# EasyEDA Pro project ProPrj_电刺激发生单元2_2024-08-09.epro

# Schematic Schematic1
Create Date: 2024-01-28; Page Name: P1; Project Name: 电刺激发生单元2; Schematic Name: Schematic1; Update Date: 2024-02-19; Company: 嘉立创EDA; Page Size: A4; Version: V1.0
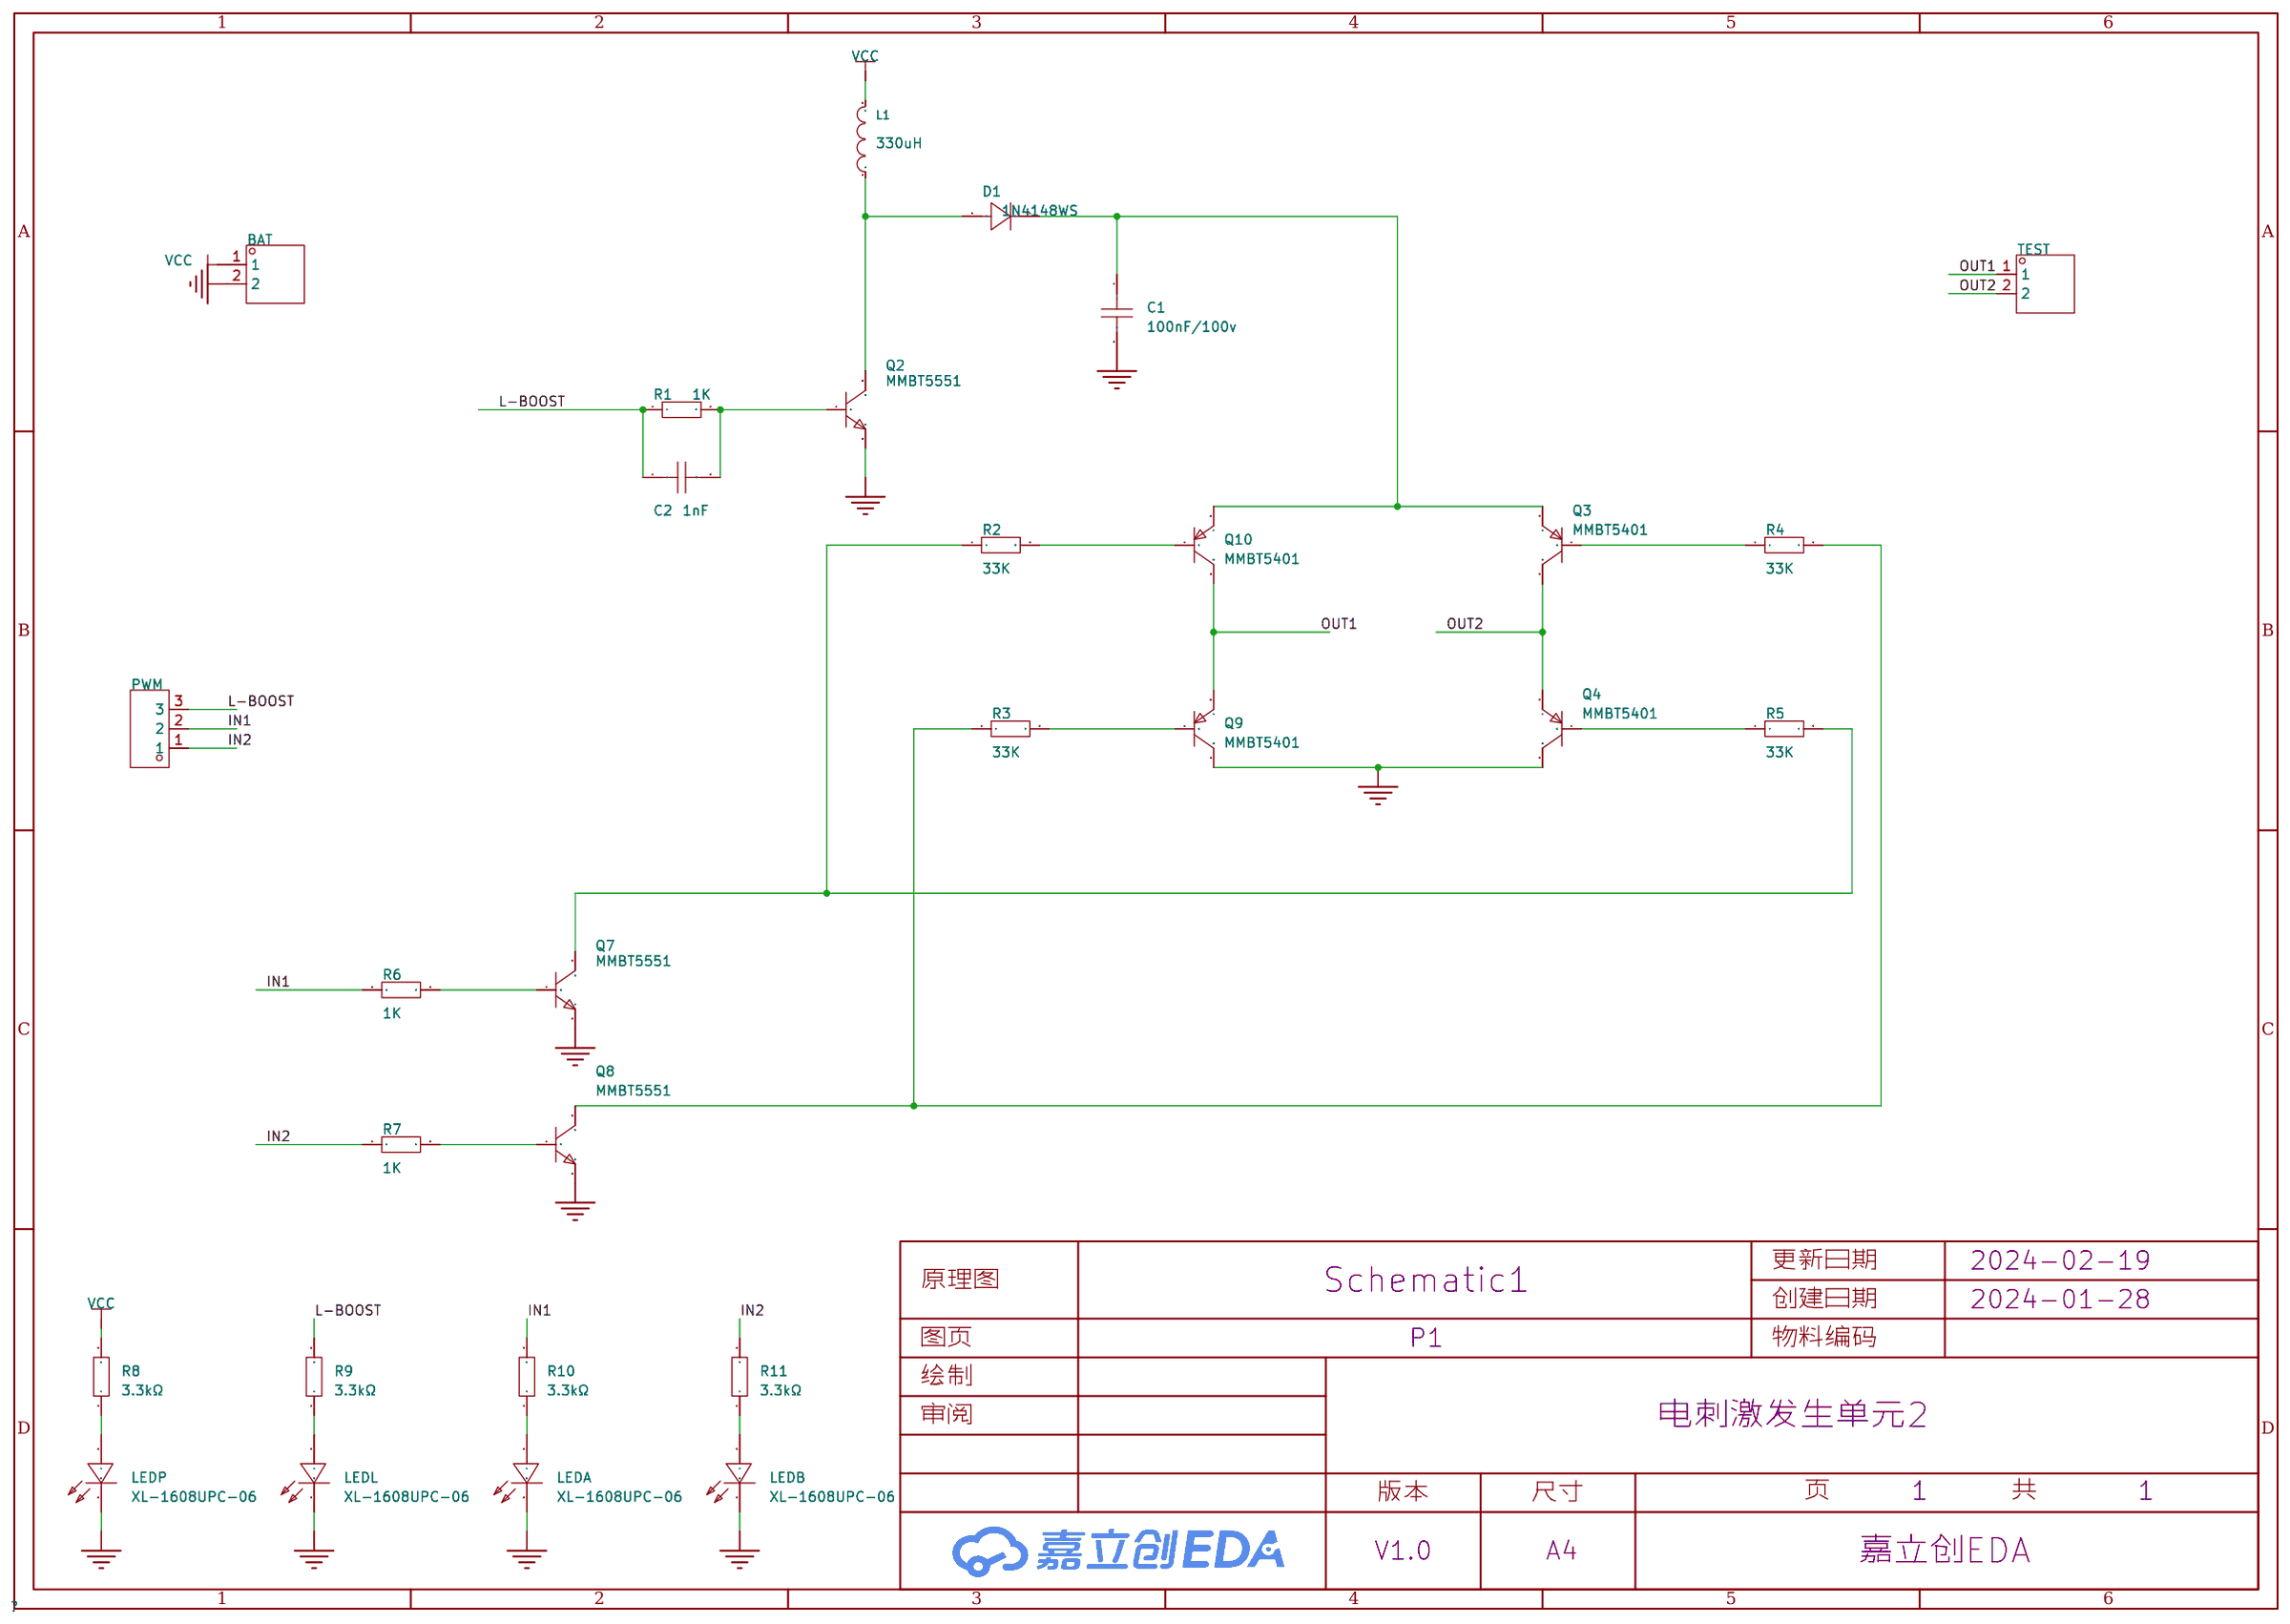
[diagram p0: schematic sheet]

## Parts
BAT  -  [HDR-TH_2P-P2.54-V-M-1]
C1  100nF  [C0603]
C2  1nF  [C0603]
D1  1N4148WS  [SOD-323_L1.8-W1.3-LS2.5-RD]
L1  330uH  [IND-SMD_L4.0-W4.0_FNR40XXS]
LEDA  XL-1608UPC-06  [LED0603-RD_PINK]
LEDB  XL-1608UPC-06  [LED0603-RD_PINK]
LEDL  XL-1608UPC-06  [LED0603-RD_PINK]
LEDP  XL-1608UPC-06  [LED0603-RD_PINK]
PWM  -  [HDR-TH_3P-P2.54-V-M]
Q2  MMBT5551  [SOT-23-3_L2.9-W1.3-P1.90-LS2.4-BR]
Q3  MMBT5401  [SOT-23-3_L2.9-W1.3-P1.90-LS2.4-BR]
Q4  MMBT5401  [SOT-23-3_L2.9-W1.3-P1.90-LS2.4-BR]
Q7  MMBT5551  [SOT-23-3_L2.9-W1.3-P1.90-LS2.4-BR]
Q8  MMBT5551  [SOT-23-3_L2.9-W1.3-P1.90-LS2.4-BR]
Q9  MMBT5401  [SOT-23-3_L2.9-W1.3-P1.90-LS2.4-BR]
Q10  MMBT5401  [SOT-23-3_L2.9-W1.3-P1.90-LS2.4-BR]
R1  1K  [R0603]
R2  33K  [R0603]
R3  33K  [R0603]
R4  33K  [R0603]
R5  33K  [R0603]
R6  1K  [R0603]
R7  1K  [R0603]
R8  3.3kΩ  [R0603]
R9  3.3kΩ  [R0603]
R10  3.3kΩ  [R0603]
R11  3.3kΩ  [R0603]
TEST  -  [HDR-TH_2P-P2.54-V-M-1]

## Library data of the parts
BAT TEST = HDR-M_2.54_1x2P: Supplier Part: C124375; Supplier Footprint: 插件
C1 = CL10B104KC8NNNC: 容值:100nF;精度:±10%;额定电压:100V;材质(温度系数):X7R;; LCSC Part Name: 100nF ±10% 100V; Supplier Part: C15725; Manufacturer: SAMSUNG(三星); Supplier Footprint: 0603; JLCPCB Part Class: Extended Part; Datasheet: https://atta.szlcsc.com/upload/public/pdf/source/20160218/1457707763339.pdf; Supplier: LCSC; Tolerance: ±10%; Voltage Rated: 100V; Temperature Coefficient: X7R
C2 = CL10B102KC8NNNC: 容值:1nF;精度:±10%;额定电压:100V;材质(温度系数):X7R;; LCSC Part Name: 1nF ±10% 100V; Supplier Part: C153291; Manufacturer: SAMSUNG(三星); Supplier Footprint: 0603; JLCPCB Part Class: Extended Part; Datasheet: https://atta.szlcsc.com/upload/public/pdf/source/20160218/1457707763339.pdf; Supplier: LCSC; Tolerance: ±10%; Voltage Rated: 100V; Temperature Coefficient: X7R
D1 = 1N4148WS_C727111: 二极管配置:独立式;正向压降(Vf):1.25V@150mA;直流反向耐压(Vr):100V;平均整流电流(Io):300mA;功率:400mW;反向恢复时间(trr):8ns;; LCSC Part Name: 电压:100V 电流:300mA; Supplier Part: C727111; Manufacturer: TWGMC(台湾迪嘉); Supplier Footprint: SOD-323; JLCPCB Part Class: Extended Part; Datasheet: https://atta.szlcsc.com/upload/public/pdf/source/20200828/C727111_E7108F014A9288D320E3440593CCDF54.pdf; Supplier: LCSC; Diode Configuration: 独立式; Forward Voltage (Vf@If): 1.25V@150mA; Reverse Voltage (Vr): 100V; Average Rectified Current (Io): 300mA; Power Dissipation: 400mW; Reverse Leakage Current: 1uA@75V; Reverse Recovery Time (trr): 8ns; Operating Temperature: -55℃~+150℃@(Tj)
L1 = FNR4030S331MT: 电感值:330uH;精度:±20%;额定电流:260mA;饱和电流(Isat):400mA;; LCSC Part Name: 330uH ±20% 400mA; Supplier Part: C167900; Manufacturer: cjiang(长江微电); Supplier Footprint: SMD,4x4x3mm; JLCPCB Part Class: Extended Part; Datasheet: https://atta.szlcsc.com/upload/public/pdf/source/20190327/C167925_9EFF0AABC4CA629C2CC95961DBF7D39D.pdf; Supplier: LCSC; Tolerance: ±20%; Rated Current: 260mA; DC Resistance (DCR): 5.2Ω; Saturation Current (Isat): 400mA
LEDA LEDB LEDL LEDP = XL-1608UPC-06: 灯头类型:-;发光颜色:粉色;正向电压(VF):-;功率:80mW;正向电流:5mA;主波长:-;二极管配置:-;透镜颜色:粉色透镜;色温:-;发光强度:-;发光角度:120°;载带方式:正贴;工作温度:-30℃~+85℃;; Supplier Part: C2977076; Manufacturer: XINGLIGHT(成兴光); Supplier Footprint: 0603; JLCPCB Part Class: 扩展库; Datasheet: https://atta.szlcsc.com/upload/public/pdf/source/20221102/10CD74551B91639B3CF9699D266872B7.pdf; Supplier: LCSC; Emitted Color: 粉色; Power Dissipation: 80mW; Forward Current: 5mA; Lens Color: 粉色透镜; Viewing Angle: 120°; Mounting Sytle: 正贴; Operating Temperature: -30℃~+85℃
PWM = HDR-M_2.54_1x3P: Supplier Part: C2937625; Supplier Footprint: 插件
Q2 Q7 Q8 = MMBT5551_C511877: 晶体管类型:-;集电极电流(Ic):600mA;集射极击穿电压(Vceo):160V;功率(Pd):300mW;直流电流增益(hFE@Ic,Vce):100@10mA,5V;; LCSC Part Name: 电流:600mA 耐压:160V; Supplier Part: C511877; Manufacturer: BORN(伯恩半导体); Supplier Footprint: SOT-23; JLCPCB Part Class: 扩展库; Datasheet: https://atta.szlcsc.com/upload/public/pdf/source/20200413/C511877_5FB572CA080610ED71DCB0A2B79AF8E8.pdf; Supplier: LCSC; Collector Current (Ic): 600mA; Collector-Emitter Breakdown Voltage (Vceo): 160V; Power Dissipation (Pd): 300mW; DC Current Gain (hFE@Ic,Vce): 100@10mA,5V; Transition Frequency (fT): 300MHz; Collector Cut-Off Current (Icbo): 50nA; Collector-Emitter Saturation Voltage (VCE(sat)@Ic,Ib): 200mV@50mA,5mA
Q3 Q4 Q9 Q10 = MMBT5401_C8326: 晶体管类型:PNP;集电极电流(Ic):600mA;集射极击穿电压(Vceo):150V;功率(Pd):300mW;直流电流增益(hFE@Ic,Vce):200@10mA,5V;; LCSC Part Name: PNP 电流:600mA 耐压:150V hfe=200~300; Supplier Part: C8326; Manufacturer: CJ(江苏长电/长晶); Supplier Footprint: SOT-23; JLCPCB Part Class: 基础库; Datasheet: https://atta.szlcsc.com/upload/public/pdf/source/20140809/1457707213644.pdf; Supplier: LCSC; Transistor Type: PNP; Collector Current (Ic): 600mA; Collector-Emitter Breakdown Voltage (Vceo): 150V; Power Dissipation (Pd): 300mW; DC Current Gain (hFE@Ic,Vce): 200@10mA,5V; Transition Frequency (fT): 100MHz; Collector Cut-Off Current (Icbo): 100nA; Collector-Emitter Saturation Voltage (VCE(sat)@Ic,Ib): 500mV@50mA,5mA
R1-R7 = Res_0603: Supplier Footprint: 0603
R8-R11 = 0603WAF3301T5E: 阻值:3.3kΩ;精度:±1%;功率:100mW;温度系数:±100ppm/℃;电阻类型:厚膜电阻;; LCSC Part Name: 3.3kΩ ±1% 100mW 厚膜电阻; Supplier Part: C22978; Manufacturer: UNI-ROYAL(厚声); Supplier Footprint: 0603; JLCPCB Part Class: 基础库; Datasheet: https://atta.szlcsc.com/upload/public/pdf/source/20200306/C422600_1E6D84923E4A46A82E41ADD87F860B5C.pdf; Supplier: LCSC; Tolerance: ±1%; Power(Watts): 100mW; Overload Voltage (Max): 75V; Temperature Coefficient: ±100ppm/℃; Type: 厚膜电阻; Operating Temperature Range: -55℃~+155℃

## Nets
GND: BAT.2 C1.2 LEDA.1(C) LEDB.1(C) LEDL.1(C) LEDP.1(C) Q2.2(E) Q4.3(C) Q7.2(E) Q8.2(E) Q9.3(C)
VCC: BAT.1 L1.2 R8.2
IN1: PWM.2 R6.1 R10.2
IN2: PWM.1 R7.1 R11.2
L-BOOST: C2.1 PWM.3 R1.1 R9.2
OUT1: Q9.2(E) Q10.3(C) TEST.1
OUT2: Q3.3(C) Q4.2(E) TEST.2
$1N633: C2.2 Q2.1(B) R1.2
$1N635: C1.1 D1.1(K) Q3.2(E) Q10.2(E)
$1N636: Q10.1(B) R2.2
$1N637: Q4.1(B) R5.1
$1N638: Q9.1(B) R3.2
$1N639: Q7.3(C) R2.1 R5.2
$1N640: Q3.1(B) R4.1
$1N641: Q8.3(C) R3.1 R4.2
$1N644: Q7.1(B) R6.2
$1N645: Q8.1(B) R7.2
$1N1569: D1.2(A) L1.1 Q2.3(C)
$1N3237: LEDP.2(A) R8.1
$1N5710: LEDL.2(A) R9.1
$1N5808: LEDA.2(A) R10.1
$1N5903: LEDB.2(A) R11.1

# Schematic Schematic2
Create Date: 2024-02-03; Page Name: P1; Project Name: 电刺激发生单元2; Schematic Name: Schematic2; Update Date: 2024-02-03; Company: 嘉立创EDA; Page Size: A4; Version: V1.0
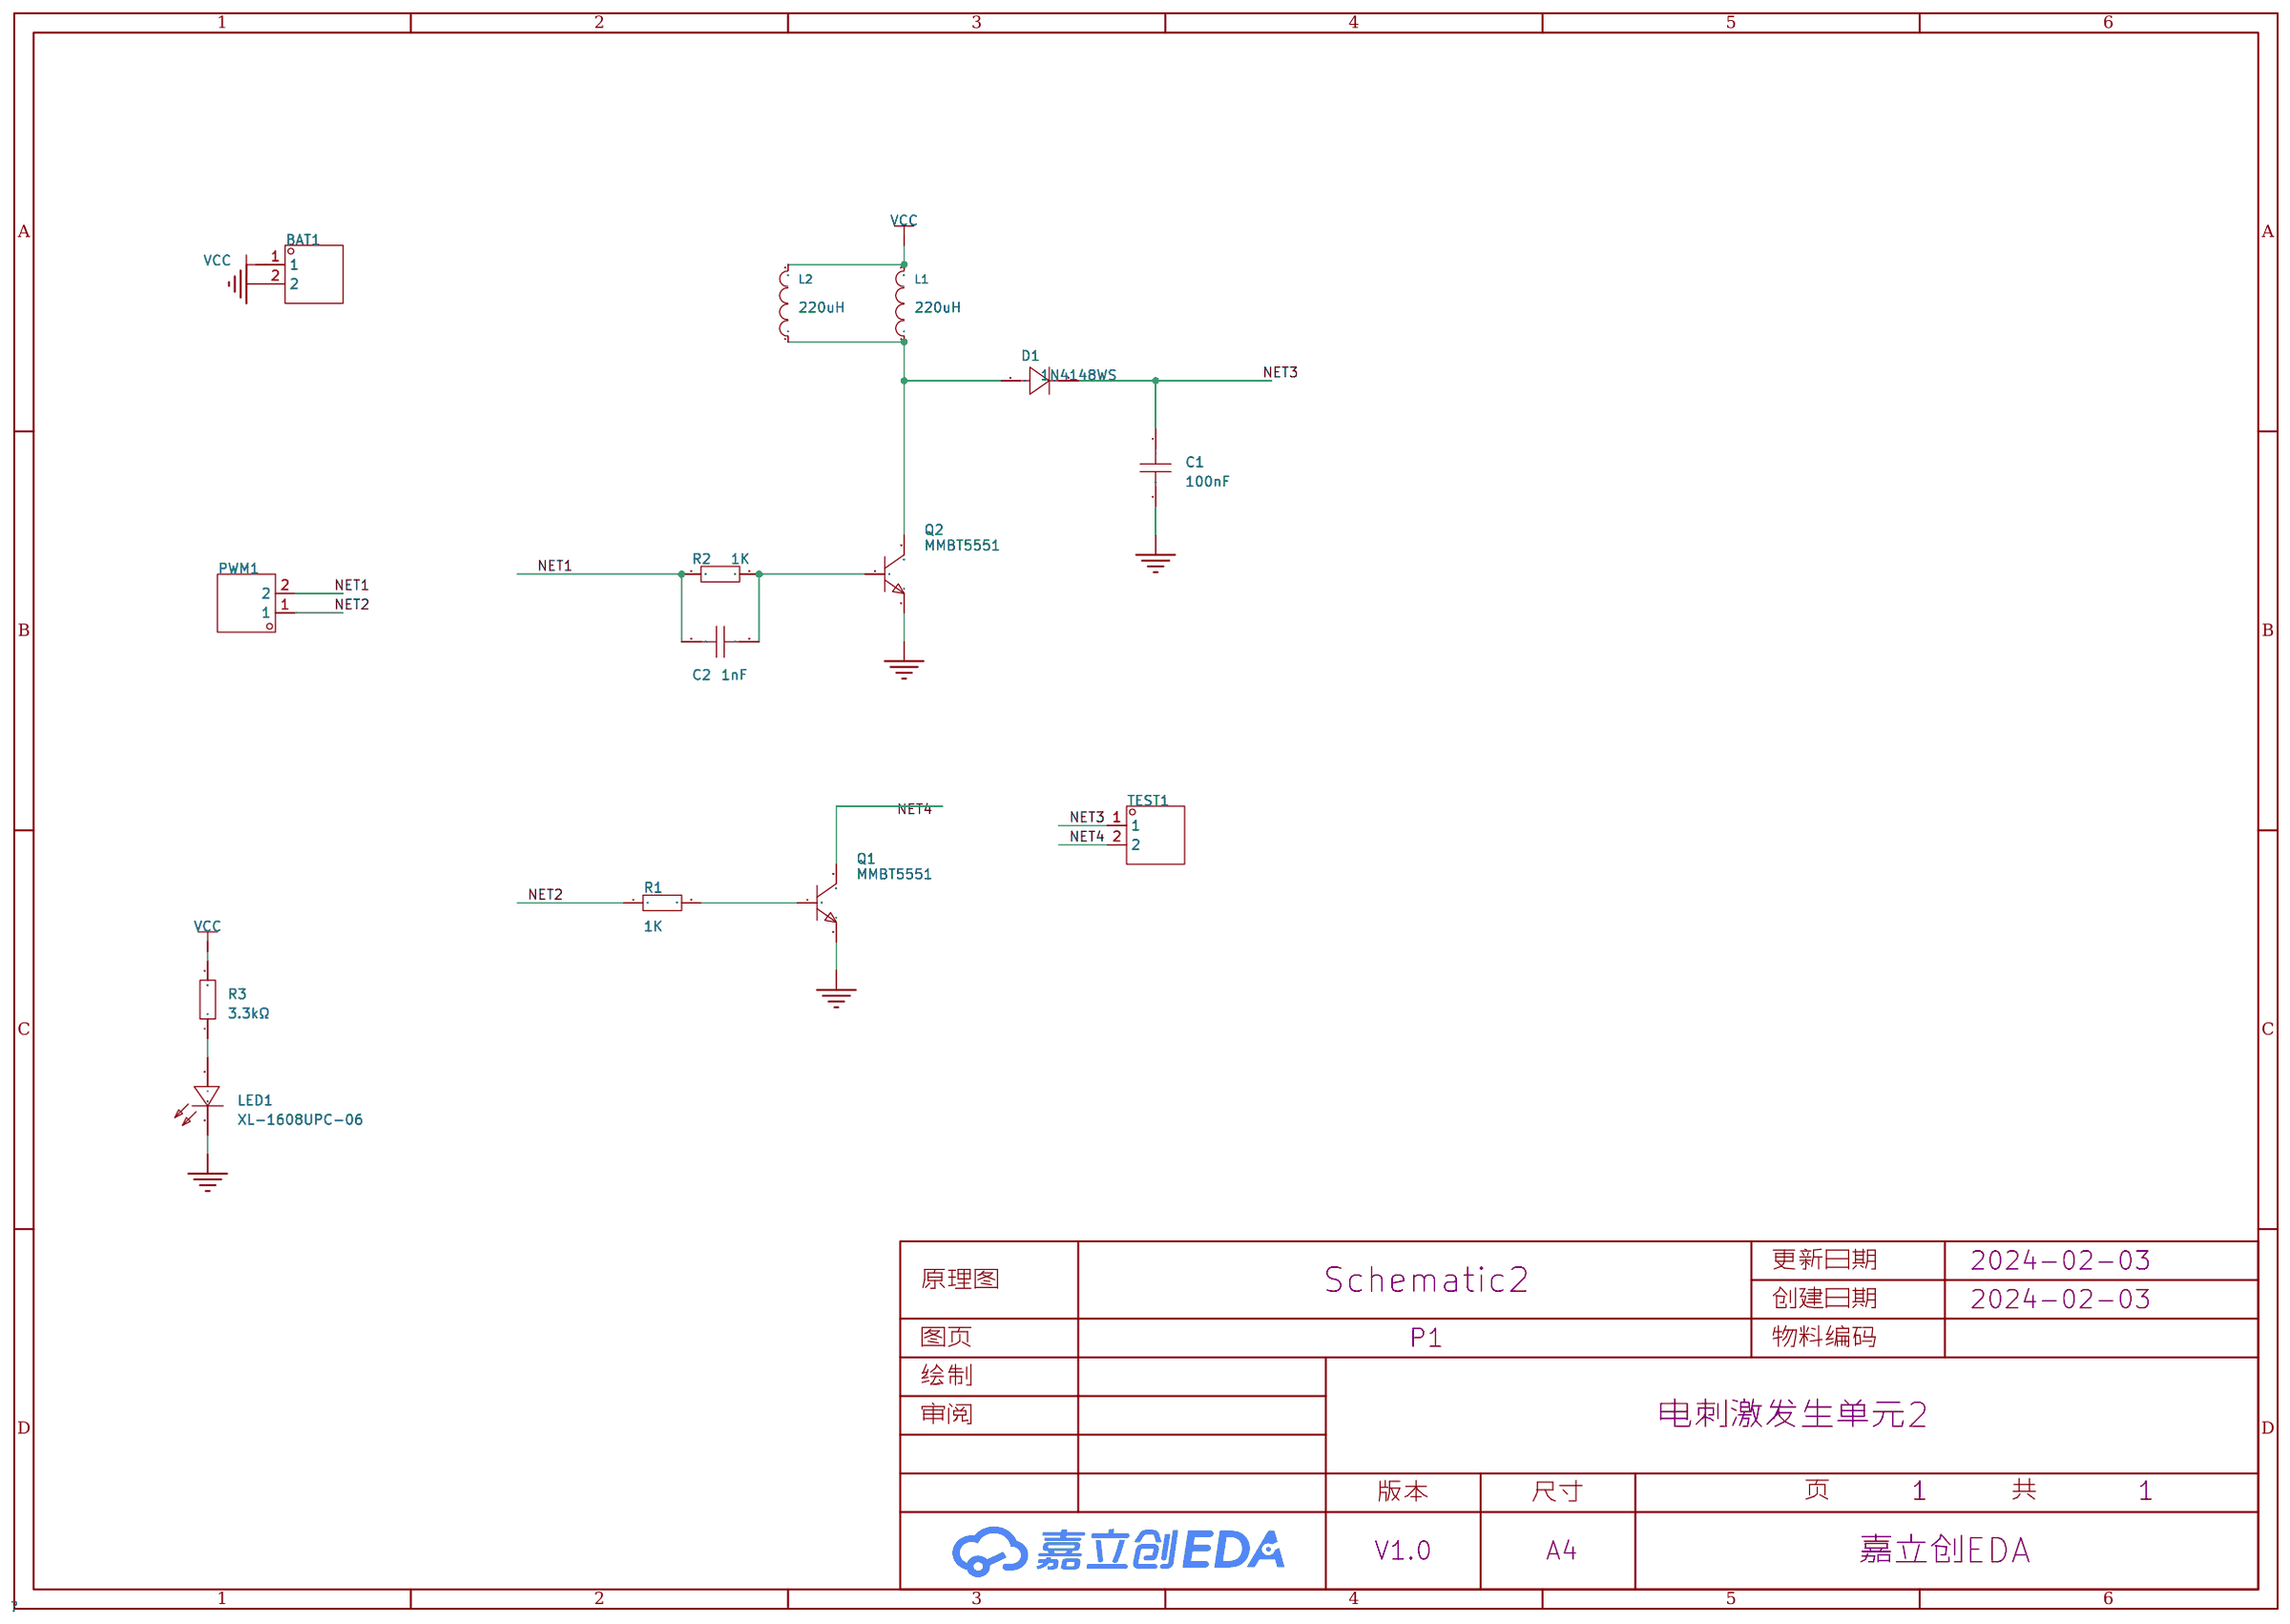
[diagram p1: schematic sheet]

## Parts
BAT1  -  [HDR-TH_2P-P2.54-V-M-1]
C1  100nF  [C0805]
C2  1nF  [C0603]
D1  1N4148WS  [SOD-323_L1.8-W1.3-LS2.5-RD]
L1  220uH  [IND-SMD_L3.0-W3.0_LVS303015H-2R2M-N]
L2  220uH  [L1207]
LED1  XL-1608UPC-06  [LED0603-RD_PINK]
PWM1  -  [HDR-TH_2P-P2.54-V-M-1]
Q1  MMBT5551  [SOT-23-3_L2.9-W1.3-P1.90-LS2.4-BR]
Q2  MMBT5551  [SOT-23-3_L2.9-W1.3-P1.90-LS2.4-BR]
R1  1K  [R0603]
R2  1K  [R0603]
R3  3.3kΩ  [R0603]
TEST1  -  [HDR-TH_2P-P2.54-V-M-1]

## Library data of the parts
BAT1 PWM1 TEST1 = HDR-M_2.54_1x2P: Supplier Part: C124375; Supplier Footprint: 插件
C1 = CL21B104KCFNNNE: 容值:100nF;精度:±10%;额定电压:100V;材质(温度系数):X7R;; LCSC Part Name: 100nF ±10% 100V; Supplier Part: C28233; Manufacturer: SAMSUNG(三星); Supplier Footprint: 0805; JLCPCB Part Class: Basic Part; Datasheet: https://atta.szlcsc.com/upload/public/pdf/source/20160218/1457707763339.pdf; Supplier: LCSC; Tolerance: ±10%; Voltage Rated: 100V; Temperature Coefficient: X7R
C2 = CL10B102KC8NNNC: 容值:1nF;精度:±10%;额定电压:100V;材质(温度系数):X7R;; LCSC Part Name: 1nF ±10% 100V; Supplier Part: C153291; Manufacturer: SAMSUNG(三星); Supplier Footprint: 0603; JLCPCB Part Class: Extended Part; Datasheet: https://atta.szlcsc.com/upload/public/pdf/source/20160218/1457707763339.pdf; Supplier: LCSC; Tolerance: ±10%; Voltage Rated: 100V; Temperature Coefficient: X7R
D1 = 1N4148WS_C727111: 二极管配置:独立式;正向压降(Vf):1.25V@150mA;直流反向耐压(Vr):100V;平均整流电流(Io):300mA;功率:400mW;反向恢复时间(trr):8ns;; LCSC Part Name: 电压:100V 电流:300mA; Supplier Part: C727111; Manufacturer: TWGMC(台湾迪嘉); Supplier Footprint: SOD-323; JLCPCB Part Class: Extended Part; Datasheet: https://atta.szlcsc.com/upload/public/pdf/source/20200828/C727111_E7108F014A9288D320E3440593CCDF54.pdf; Supplier: LCSC; Diode Configuration: 独立式; Forward Voltage (Vf@If): 1.25V@150mA; Reverse Voltage (Vr): 100V; Average Rectified Current (Io): 300mA; Power Dissipation: 400mW; Reverse Leakage Current: 1uA@75V; Reverse Recovery Time (trr): 8ns; Operating Temperature: -55℃~+150℃@(Tj)
L1 = XRCD32-221K: 电感值:220uH;精度:±10%;; LCSC Part Name: 220uH ±10%; Supplier Part: C5289391; Manufacturer: XR(祥如); Supplier Footprint: SMD,2.1x3mm; JLCPCB Part Class: Extended Part; Datasheet: https://atta.szlcsc.com/upload/public/pdf/source/20231010/F8DFC35BD01DC108FC822E3F44DEF6B3.pdf; Supplier: LCSC; Tolerance: ±10%; Rated Current: 260mA; DC Resistance (DCR): 5.2Ω; Saturation Current (Isat): 400mA
L2 = LB3218T221M: 电感值:220uH;精度:±20%;额定电流:80mA;饱和电流(Isat):-;直流电阻(DCR):5.4Ω;; LCSC Part Name: 220uH ±20%; Supplier Part: C223393; Manufacturer: TAIYO YUDEN(太诱); Supplier Footprint: 1206; JLCPCB Part Class: Extended Part; Datasheet: https://atta.szlcsc.com/upload/public/pdf/source/20190423/C223308_BFD65E337BAACD8D50F53C3994BF310F.pdf; Supplier: LCSC; Tolerance: ±20%; Rated Current: 80mA; DC Resistance (DCR): 5.4Ω; Frequency - Self Resonant: 252kHz; Type: 绕线片式电感
LED1 = XL-1608UPC-06: 灯头类型:-;发光颜色:粉色;正向电压(VF):-;功率:80mW;正向电流:5mA;主波长:-;二极管配置:-;透镜颜色:粉色透镜;色温:-;发光强度:-;发光角度:120°;载带方式:正贴;工作温度:-30℃~+85℃;; Supplier Part: C2977076; Manufacturer: XINGLIGHT(成兴光); Supplier Footprint: 0603; JLCPCB Part Class: 扩展库; Datasheet: https://atta.szlcsc.com/upload/public/pdf/source/20221102/10CD74551B91639B3CF9699D266872B7.pdf; Supplier: LCSC; Emitted Color: 粉色; Power Dissipation: 80mW; Forward Current: 5mA; Lens Color: 粉色透镜; Viewing Angle: 120°; Mounting Sytle: 正贴; Operating Temperature: -30℃~+85℃
Q1 Q2 = MMBT5551_C511877: 晶体管类型:-;集电极电流(Ic):600mA;集射极击穿电压(Vceo):160V;功率(Pd):300mW;直流电流增益(hFE@Ic,Vce):100@10mA,5V;; LCSC Part Name: 电流:600mA 耐压:160V; Supplier Part: C511877; Manufacturer: BORN(伯恩半导体); Supplier Footprint: SOT-23; JLCPCB Part Class: 扩展库; Datasheet: https://atta.szlcsc.com/upload/public/pdf/source/20200413/C511877_5FB572CA080610ED71DCB0A2B79AF8E8.pdf; Supplier: LCSC; Collector Current (Ic): 600mA; Collector-Emitter Breakdown Voltage (Vceo): 160V; Power Dissipation (Pd): 300mW; DC Current Gain (hFE@Ic,Vce): 100@10mA,5V; Transition Frequency (fT): 300MHz; Collector Cut-Off Current (Icbo): 50nA; Collector-Emitter Saturation Voltage (VCE(sat)@Ic,Ib): 200mV@50mA,5mA
R1 R2 = Res_0603: Supplier Footprint: 0603
R3 = 0603WAF3301T5E: 阻值:3.3kΩ;精度:±1%;功率:100mW;温度系数:±100ppm/℃;电阻类型:厚膜电阻;; LCSC Part Name: 3.3kΩ ±1% 100mW 厚膜电阻; Supplier Part: C22978; Manufacturer: UNI-ROYAL(厚声); Supplier Footprint: 0603; JLCPCB Part Class: 基础库; Datasheet: https://atta.szlcsc.com/upload/public/pdf/source/20200306/C422600_1E6D84923E4A46A82E41ADD87F860B5C.pdf; Supplier: LCSC; Tolerance: ±1%; Power(Watts): 100mW; Overload Voltage (Max): 75V; Temperature Coefficient: ±100ppm/℃; Type: 厚膜电阻; Operating Temperature Range: -55℃~+155℃

## Nets
GND: BAT1.2 C1.2 LED1.1(C) Q1.2(E) Q2.2(E)
VCC: BAT1.1 L1.2 L2.2 R3.2
NET1: C2.1 PWM1.2 R2.1
NET2: PWM1.1 R1.1
NET3: C1.1 D1.1(K) TEST1.1
NET4: Q1.3(C) TEST1.2
$1N914: C2.2 Q2.1(B) R2.2
$1N925: Q1.1(B) R1.2
$1N950: LED1.2(A) R3.1
$1N1295: D1.2(A) L1.1 L2.1 Q2.3(C)

# Board PCB1
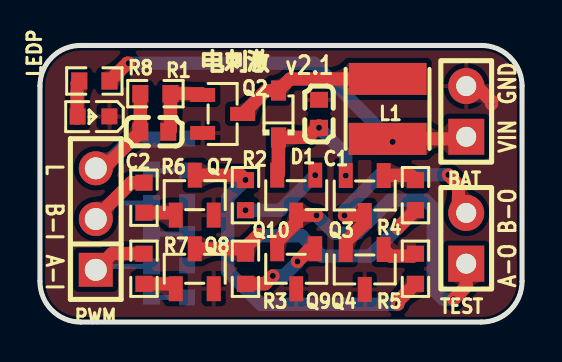
[diagram p2: board, top side]
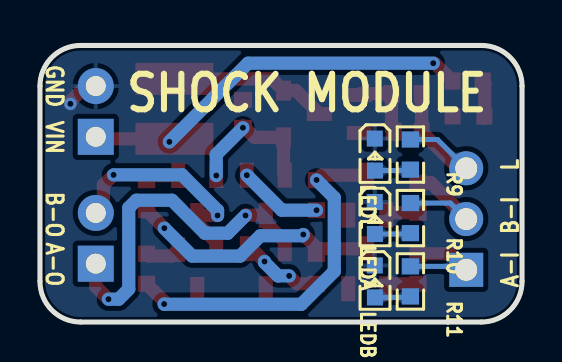
[diagram p3: board, bottom side, seen from below]

Outline 24.13 x 13.84 mm; copper layers: Top Layer, Bottom Layer. Coordinates in mm from the lower left corner of the outline.
Outline path: 0,11.81 0,2.03 arc(0.6,0.6) 2.03,0 22.1,0 arc(23.53,0.6) 24.13,2.03 24.13,11.81 arc(23.53,13.25) 22.1,13.84 2.03,13.84 arc(0.6,13.25) 0,11.81
Stack: Top Layer 0.035mm / Dielectric1 1.51mm FR4 er 4.5 / Bottom Layer 0.035mm

## Design rules (mm)
template: JLCPCB Capability(Two Layers Board)
spacing copperThickness1oz (default): track to track 0.102, other pairs 0.152 to 0.3
spacing copperThickness2oz: track to track 0.203, other pairs 0.152 to 0.3
track width copperThickness1oz (default): min 0.127, default 0.254, max 2.54
track width copperThickness2oz: min 0.203, default 0.254, max 2.54
differential pair differentialPair (default): width min 0.127, default 0.254, max 2.54; gap min 0.152, default 0.152
via viaSize (default): diameter min 0.5, default 0.61, max 10; hole min 0.3, default 0.305, max 6.3

## Placement (name value [footprint] x y rotation side)
BAT  -  [HDR-TH_2P-P2.54-V-M-1]  21.34 10.54 90 top
C1  100nF  [C0603]  13.97 10.42 90 top
C2  1nF  [C0603]  5.72 9.53 0 top
D1  1N4148WS  [SOD-323_L1.8-W1.3-LS2.5-RD]  11.94 10.41 90 top
L1  330uH  [IND-SMD_L4.0-W4.0_FNR40XXS]  17.4 10.67 270 top
LEDA  XL-1608UPC-06  [LED0603-RD_PINK]  7.37 5.21 270 bottom
LEDB  XL-1608UPC-06  [LED0603-RD_PINK]  7.37 2.03 270 bottom
LEDL  XL-1608UPC-06  [LED0603-RD_PINK]  7.37 8.38 270 bottom
LEDP  XL-1608UPC-06  [LED0603-RD_PINK]  2.68 10.29 180 top
PWM  -  [HDR-TH_3P-P2.54-V-M]  2.79 5.15 90 top
Q2  MMBT5551  [SOT-23-3_L2.9-W1.3-P1.90-LS2.4-BR]  9.14 10.41 180 top
Q3  MMBT5401  [SOT-23-3_L2.9-W1.3-P1.90-LS2.4-BR]  16.26 6.33 90 top
Q4  MMBT5401  [SOT-23-3_L2.9-W1.3-P1.90-LS2.4-BR]  16.26 2.63 90 top
Q7  MMBT5551  [SOT-23-3_L2.9-W1.3-P1.90-LS2.4-BR]  7.75 6.35 270 top
Q8  MMBT5551  [SOT-23-3_L2.9-W1.3-P1.90-LS2.4-BR]  7.75 2.67 270 top
Q9  MMBT5401  [SOT-23-3_L2.9-W1.3-P1.90-LS2.4-BR]  12.83 2.67 90 top
Q10  MMBT5401  [SOT-23-3_L2.9-W1.3-P1.90-LS2.4-BR]  12.83 6.35 90 top
R1  1K  [R0603]  5.78 11.43 0 top
R2  33K  [R0603]  10.29 6.35 270 top
R3  33K  [R0603]  10.29 2.67 270 top
R4  33K  [R0603]  18.8 6.35 270 top
R5  33K  [R0603]  18.8 2.67 270 top
R6  1K  [R0603]  5.21 6.22 270 top
R7  1K  [R0603]  5.21 2.67 270 top
R8  3.3kΩ  [R0603]  2.72 12.06 0 top
R9  3.3kΩ  [R0603]  5.59 8.38 90 bottom
R10  3.3kΩ  [R0603]  5.59 5.2 90 bottom
R11  3.3kΩ  [R0603]  5.59 2.03 90 bottom
TEST  -  [HDR-TH_2P-P2.54-V-M-1]  21.34 4.19 90 top

## Footprints (pads in the part's own frame, mm; a bottom-side part is the same pattern mirrored in y, then rotated)
C0603
  rect 0.8x0.9 smd: 1(-0.7,0) 2(0.7,0)
HDR-TH_2P-P2.54-V-M-1
  rect 1.8x1.8 hole 1: 1(-1.27,0)
  round 1.8 hole 1: 2(1.27,0)
HDR-TH_3P-P2.54-V-M
  rect 1.7x1.7 hole 1.1: 1(-2.54,0)
  round 1.7 hole 1.1: 2(0,0) 3(2.54,0)
IND-SMD_L4.0-W4.0_FNR40XXS
  rect 1.6x3.9 smd: 1(-1.5,0) 2(1.5,0)
LED0603-RD_PINK
  rect 0.8x0.8 smd: 1(-0.799,-0.004) 2(0.799,0.004)
R0603
  rect 0.806x0.864 smd: 1(-0.753,0) 2(0.753,0)
SOD-323_L1.8-W1.3-LS2.5-RD
  rect 1x0.75 smd: 1(-1.173,0) 2(1.173,0)
SOT-23-3_L2.9-W1.3-P1.90-LS2.4-BR
  rect 1.25x0.7 smd: 1(1,-0.95) 2(1,0.95) 3(-1,0)

## Nets
As in the schematic.

## Via types
v1: diameter 0.61, hole 0.305, Top Layer to Bottom Layer, 17 vias

## Routing (per net, layer and track width the routed paths; a pad name or vN(x,y) marks a point on that pad's centre or on a via; arc(x,y) is an arc through that point)
GND: length 1.7
  Top Layer w0.66: v1(22.61,10.92) 22.61,11.05 21.84,11.81 BAT.2
VCC: length 20.5
  Top Layer w0.66: 3.48,12.06 4.37,12.95 v1(4.44,12.95) ; BAT.1 21.23,9.17 L1.2 17.55,9.02 v1(17.65,9.02)
  Bottom Layer w0.66: v1(17.65,9.02) 13.72,12.95 v1(4.44,12.95)
IN1: length 6.3
  Top Layer w0.66: R6.1 4.56,6.98 2.79,5.21 PWM.2
  Bottom Layer w0.254: PWM.2 3.6,5.96 5.59,5.96
IN2: length 5.6
  Top Layer w0.66: 2.79,2.61 3.6,3.42 R7.1
  Bottom Layer w0.254: 2.79,2.61 2.97,2.79 R11.2
L-BOOST: length 8.3
  Top Layer w0.66: PWM.3 3.19,7.69 C2.1 5.03,9.53 R1.1
  Bottom Layer w0.254: R9.2 4.24,9.14 PWM.3
OUT1: length 17.5
  Top Layer w0.66: v1(20.7,1.14) 21.34,1.78 TEST.1 ; Q9.2 11.88,4.03 12.83,4.98 Q10.3 13.83,5.35 v1(13.84,5.33)
  Bottom Layer w0.66: v1(20.7,1.14) 20.19,1.14 19.69,1.65 19.69,5.72 19.3,6.1 17.53,6.1 15.88,4.45 14.73,4.45 v1(13.84,5.33)
OUT2: length 11.6
  Top Layer w0.66: v1(15.24,5.33) 16.25,5.33 ; Q4.2 15.31,4 16.26,4.95 Q3.3 ; TEST.2 20.96,5.84 20.96,6.86 v1(20.45,7.37)
  Bottom Layer w0.66: v1(15.24,5.33) 15.24,5.59 17.02,7.37 v1(20.45,7.37)
$1N633: length 3.6
  Top Layer w0.66: Q2.1 8.08,11.43 R1.2 6.53,9.63 C2.2
$1N635: length 7.1
  Top Layer w0.254: 11.94,7.41 Q10.2
  Top Layer w0.66: 11.94,7.41 D1.1 13.39,9.24 13.97,9.82
  Bottom Layer w0.66: v1(15.31,7.33) 15.31,8.39 v1(13.97,9.72)
$1N636: length 4.2
  Bottom Layer w0.66: v1(10.29,5.6) 12.02,5.6 v1(13.78,7.35)
$1N637: length 1.8
  Top Layer w0.66: Q4.1 17.54,3.3 18.68,3.3 R5.1
$1N638: length 4.2
  Top Layer w0.66: Q9.1 13.7,3.59 13.45,3.59 v1(12.89,3.03) ; v1(11.66,2.31) 11.26,1.91 R3.2
  Bottom Layer w0.66: v1(11.66,2.31) 12.22,2.31 12.89,2.98 v1(12.89,3.03)
$1N639: length 18.2
  Top Layer w0.66: R5.2 17.91,1.03 v1(17.91,0.9) ; v1(10.29,7.11) R2.1 10.04,7.35 Q7.3
  Bottom Layer w0.66: v1(17.91,0.9) 17.9,0.89 11.05,0.89 9.4,2.54 9.4,6.22 v1(10.29,7.11)
$1N640: length 1.7
  Top Layer w0.66: Q3.1 18.57,7.33 R4.1
$1N641: length 13.1
  Top Layer w0.66: v1(17.91,4.7) 17.91,4.71 R4.2 ; v1(10.95,4.38) 10.29,3.72 R3.1 10.04,3.67 Q8.3
  Bottom Layer w0.66: v1(10.95,4.38) 11.01,4.32 13.1,4.32 14.11,3.3 16.51,3.3 v1(17.91,4.7)
$1N644: length 1.6
  Top Layer w0.66: Q7.1 6.68,5.47 R6.2
$1N645: length 1.7
  Top Layer w0.66: Q8.1 6.55,1.91 R7.2
$1N1569: length 8
  Top Layer w0.66: L1.1 12.52,12.17 D1.2 11.32,11.59 Q2.3
$1N3237: length 1.9
  Top Layer w0.66: 1.98,12.06 1.86,11.95 1.86,10.19
$1N5710: length 1.8
  Bottom Layer w0.254: R9.1 5.63,7.58 LEDL.2
$1N5808: length 1.8
  Bottom Layer w0.254: LEDA.2 5.63,4.41 R10.1
$1N5903: length 1.8
  Bottom Layer w0.254: R11.1 5.63,1.23 LEDB.2

## Copper pours and planes (outline as drawn; the poured copper is in the pictures)
GND on Top Layer: -1.52,14.61 24.89,14.61 24.89,-1.65 -1.52,-1.65
GND on Bottom Layer: -0.63,15.49 25.91,15.49 25.91,-0.89 -0.63,-0.89

Small or netless copper shapes (teardrops, artwork), in the pictures only: 54 on Top Layer, 15 on Bottom Layer

## Text on the board
Bottom Silkscreen Layer: GND | VIN | L | B-I | A-I | B-O | A-O | SHOCK MODULE
Top Silkscreen Layer: GND | VIN | B-O | A-O | L | B-I | A-I | v2.1 | 电刺激

# Board PCB2
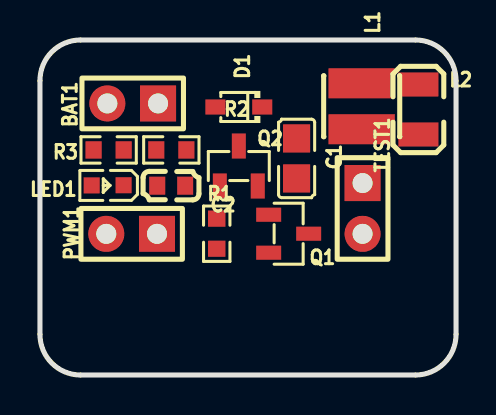
[diagram p4: board, top side]
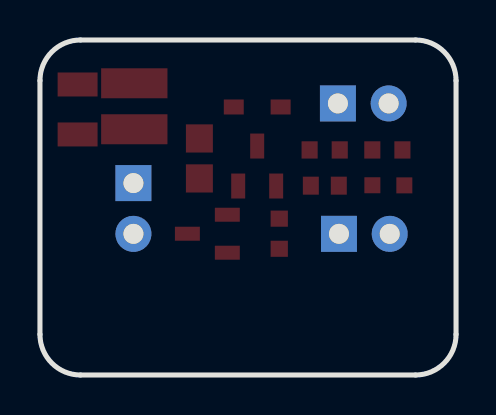
[diagram p5: board, bottom side, seen from below]

Outline 20.83 x 16.76 mm; copper layers: Top Layer, Bottom Layer. Coordinates in mm from the lower left corner of the outline.
Outline path: 0,14.73 0,2.03 arc(0.6,0.6) 2.03,0 18.8,0 arc(20.23,0.6) 20.83,2.03 20.83,14.73 arc(20.23,16.17) 18.8,16.76 2.03,16.76 arc(0.6,16.17) 0,14.73
Stack: Top Layer 0.035mm / Dielectric1 1.51mm FR4 er 4.5 / Bottom Layer 0.035mm

## Design rules (mm)
template: JLCPCB Capability(Two Layers Board)
spacing copperThickness1oz (default): track to track 0.102, other pairs 0.152 to 0.3
spacing copperThickness2oz: track to track 0.203, other pairs 0.152 to 0.3
track width copperThickness1oz (default): min 0.127, default 0.254, max 2.54
track width copperThickness2oz: min 0.203, default 0.254, max 2.54
differential pair differentialPair (default): width min 0.127, default 0.254, max 2.54; gap min 0.152, default 0.152
via viaSize (default): diameter min 0.5, default 0.61, max 10; hole min 0.3, default 0.305, max 6.3

## Placement (name value [footprint] x y rotation side)
BAT1  -  [HDR-TH_2P-P2.54-V-M-1]  4.64 13.59 180 top
C1  100nF  [C0805]  12.85 10.84 270 top
C2  1nF  [C0603]  6.57 9.47 0 top
D1  1N4148WS  [SOD-323_L1.8-W1.3-LS2.5-RD]  9.95 13.41 180 top
L1  220uH  [IND-SMD_L3.0-W3.0_LVS303015H-2R2M-N]  16.11 13.45 90 top
L2  220uH  [L1207]  18.94 13.29 270 top
LED1  XL-1608UPC-06  [LED0603-RD_PINK]  3.39 9.49 180 top
PWM1  -  [HDR-TH_2P-P2.54-V-M-1]  4.59 7.06 180 top
Q1  MMBT5551  [SOT-23-3_L2.9-W1.3-P1.90-LS2.4-BR]  12.45 7.07 180 top
Q2  MMBT5551  [SOT-23-3_L2.9-W1.3-P1.90-LS2.4-BR]  9.95 10.46 270 top
R1  1K  [R0603]  8.85 7.07 90 top
R2  1K  [R0603]  6.58 11.26 0 top
R3  3.3kΩ  [R0603]  3.44 11.26 0 top
TEST1  -  [HDR-TH_2P-P2.54-V-M-1]  16.15 8.33 270 top

## Footprints (pads in the part's own frame, mm; a bottom-side part is the same pattern mirrored in y, then rotated)
C0603
  rect 0.8x0.9 smd: 1(-0.7,0) 2(0.7,0)
C0805
  rect 1.41x1.35 smd: 1(-1,0) 2(1,0)
HDR-TH_2P-P2.54-V-M-1
  rect 1.8x1.8 hole 1: 1(-1.27,0)
  round 1.8 hole 1: 2(1.27,0)
IND-SMD_L3.0-W3.0_LVS303015H-2R2M-N
  rect 1.5x3.32 smd: 1(1.15,0) 2(-1.15,0)
L1207
  rect 1.2x2 smd: 1(-1.25,0) 2(1.25,0)
LED0603-RD_PINK
  rect 0.8x0.8 smd: 1(-0.799,-0.004) 2(0.799,0.004)
R0603
  rect 0.806x0.864 smd: 1(-0.753,0) 2(0.753,0)
SOD-323_L1.8-W1.3-LS2.5-RD
  rect 1x0.75 smd: 1(-1.173,0) 2(1.173,0)
SOT-23-3_L2.9-W1.3-P1.90-LS2.4-BR
  rect 1.25x0.7 smd: 1(1,-0.95) 2(1,0.95) 3(-1,0)

## Nets
As in the schematic.

## Copper pours and planes (outline as drawn; the poured copper is in the pictures)
GND on Top Layer: 32.51,45.85 62.23,45.85 62.23,17.14 32.51,17.14
GND on Bottom Layer: -1.04,-3.44 28.68,-3.44 28.68,-32.01 -1.04,-32.01

## Text on the board
Top Silkscreen Layer: 2-P | 1-L | GND | OUT | 单向脉冲版 v1.0 | 临摹版 | 电刺激
